# Altium schematic sheet Decode.SchDoc
size B; Author: E. Sims; Organization: Let's Build Rockets Inc.; SheetNumber: 4; SheetTotal: 6
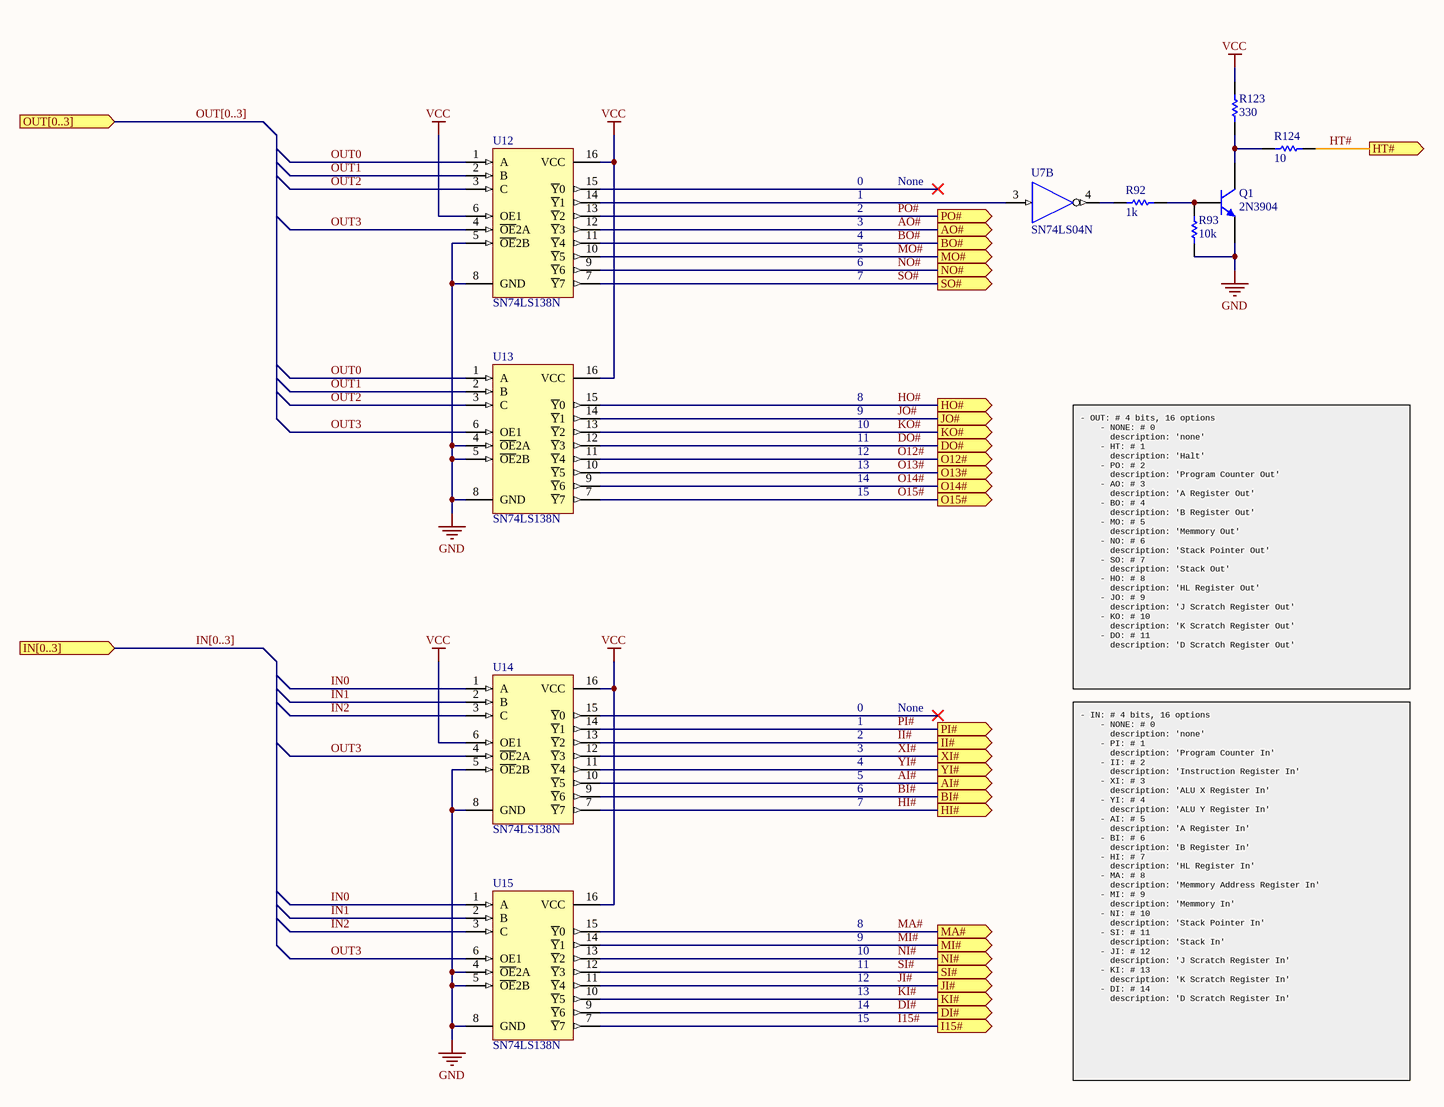
[diagram p0: Decode.SchDoc]

## Parts
Q1  2N3904  [TO-92A]
R92  value 1k  [AXIAL-0.3]  (hidden comment: Res1)
R93  value 10k  [AXIAL-0.3]  (hidden comment: Res1)
R123  value 330  [AXIAL-0.3]  (hidden comment: Res1)
R124  value 10  [AXIAL-0.3]  (hidden comment: Res1)
U7  SN74LS04N  [N014]  (part B of 6)
U12  SN74LS138N  [N016]
U13  SN74LS138N  [N016]
U14  SN74LS138N  [N016]
U15  SN74LS138N  [N016]

## Ports
AI# (out), AO# (out), BI# (out), BO# (out), DI# (out), DO# (out), HI# (out), HO# (out), HT# (out), I15# (out), II# (out), IN[0..3] (in), JI# (out), JO# (out), KI# (out), KO# (out), MA# (out), MI# (out), MO# (out), NI# (out), NO# (out), O12# (out), O13# (out), O14# (out), O15# (out), OUT[0..3] (in), PI# (out), PO# (out), SI# (out), SO# (out), XI# (out), YI# (out)

## Nets
GND: Q1.1(E) R93.2 U7.7(GND) U12.5(~{OE}2B) U12.8(GND) U13.4(~{OE}2A) U13.5(~{OE}2B) U13.8(GND) U14.5(~{OE}2B) U14.8(GND) U15.4(~{OE}2A) U15.5(~{OE}2B) U15.8(GND)
VCC: R123.1 U7.14(VCC) U12.6(OE1) U12.16(VCC) U13.16(VCC) U14.6(OE1) U14.16(VCC) U15.16(VCC)
AI#: U14.10(~{Y}5) ; port AI#
AO#: U12.12(~{Y}3) ; port AO#
BI#: U14.9(~{Y}6) ; port BI#
BO#: U12.11(~{Y}4) ; port BO#
DI#: U15.9(~{Y}6) ; port DI#
DO#: U13.12(~{Y}3) ; port DO#
HI#: U14.7(~{Y}7) ; port HI#
HO#: U13.15(~{Y}0) ; port HO#
HT#: R124.1 ; port HT#
I15#: U15.7(~{Y}7) ; port I15#
II#: U14.13(~{Y}2) ; port II#
IN0: U14.1(A) U15.1(A)
IN1: U14.2(B) U15.2(B)
IN2: U14.3(C) U15.3(C)
JI#: U15.11(~{Y}4) ; port JI#
JO#: U13.14(~{Y}1) ; port JO#
KI#: U15.10(~{Y}5) ; port KI#
KO#: U13.13(~{Y}2) ; port KO#
MA#: U15.15(~{Y}0) ; port MA#
MI#: U15.14(~{Y}1) ; port MI#
MO#: U12.10(~{Y}5) ; port MO#
NI#: U15.13(~{Y}2) ; port NI#
NO#: U12.9(~{Y}6) ; port NO#
O12#: U13.11(~{Y}4) ; port O12#
O13#: U13.10(~{Y}5) ; port O13#
O14#: U13.9(~{Y}6) ; port O14#
O15#: U13.7(~{Y}7) ; port O15#
OUT0: U12.1(A) U13.1(A)
OUT1: U12.2(B) U13.2(B)
OUT2: U12.3(C) U13.3(C)
OUT3: U12.4(~{OE}2A) U13.6(OE1) U14.4(~{OE}2A) U15.6(OE1)
PI#: U14.14(~{Y}1) ; port PI#
PO#: U12.13(~{Y}2) ; port PO#
SI#: U15.12(~{Y}3) ; port SI#
SO#: U12.7(~{Y}7) ; port SO#
XI#: U14.12(~{Y}3) ; port XI#
YI#: U14.11(~{Y}4) ; port YI#
NetQ1_2: Q1.2(B) R92.1 R93.1
NetQ1_3: Q1.3(C) R123.2 R124.2
NetR92_2: R92.2 U7.4(Y)
NetU7_3: U7.3(A) U12.14(~{Y}1)

Not connected (* = marked no-connect by the designer): U12 15(~{Y}0)*; U14 15(~{Y}0)*

## Buses and harness runs
bus IN[0..3] = port IN[0..3]
bus OUT[0..3] = port OUT[0..3]

## Notes on the sheet
- 0
- 1
- 2
- None
- 3
- 4
- 5
- 6
- 7
- 8
- 9
- 10
- 11
- 12
- 13
- 14
- 15
- - OUT: # 4 bits, 16 options
  - NONE: # 0
  description: 'none'
  - HT: # 1
  description: 'Halt'
  - PO: # 2
  description: 'Program Counter Out'
  - AO: # 3
  description: 'A Register Out'
  - BO: # 4
  description: 'B Register Out'
  - MO: # 5
  description: 'Memmory Out'
  - NO: # 6
  description: 'Stack Pointer Out'
  - SO: # 7
  description: 'Stack Out'
  - HO: # 8
  description: 'HL Register Out'
  - JO: # 9
  description: 'J Scratch Register Out'
  - KO: # 10
  description: 'K Scratch Register Out'
  - DO: # 11
  description: 'D Scratch Register Out'
- - IN: # 4 bits, 16 options
  - NONE: # 0
  description: 'none'
  - PI: # 1
  description: 'Program Counter In'
  - II: # 2
  description: 'Instruction Register In'
  - XI: # 3
  description: 'ALU X Register In'
  - YI: # 4
  description: 'ALU Y Register In'
  - AI: # 5
  description: 'A Register In'
  - BI: # 6
  description: 'B Register In'
  - HI: # 7
  description: 'HL Register In'
  - MA: # 8
  description: 'Memmory Address Register In'
  - MI: # 9
  description: 'Memmory In'
  - NI: # 10
  description: 'Stack Pointer In'
  - SI: # 11
  description: 'Stack In'
  - JI: # 12
  description: 'J Scratch Register In'
  - KI: # 13
  description: 'K Scratch Register In'
  - DI: # 14
  description: 'D Scratch Register In'
- Let's Build Rocket's Inc. Modular Paylaod System Based on TMP-010 Rev
  For more information visit https://github.com/LetsBuildRockets/Modular-Payload-System
  This work is licensed under CC BY-NC 4.0. To view a copy of this license, visit https://creativecommons.org/licenses/by-nc/4.0
- Title
- Size:
- Date:
- Assembly Variant:
- B
- Number:
- Time:
- Revision:
- Sheet
- of
- Author:
- File:

## Library data of the parts
Q1 = 2N3904: NPN General Purpose Amplifier; Published: 8-Jun-2000; LatestRevisionDate: 15-Jan-2003; LatestRevisionNote: PCB Footprint 'BCY-W3/D4.7' replaced; DatasheetVersion: 1997; PackageVersion: Sep-1998; PackageReference: TO-92A; Publisher: Altium Limited; PackageDescription: TO, Flat Index; 3 In-Line, Axial Leads; Body Dia. 4.5mm; Leads 0.51 x 0.48 mm (max); ComponentLink1Description: Manufacturer Link; ComponentLink1URL: http://www.fairchildsemi.com/; ComponentLink2Description: Datasheet; ComponentLink2URL: http://www.fairchildsemi.com/ds/2N%2F2N3904.pdf
R92 R93 R123 R124 = Res1: Resistor; Published: 8-Jun-2000; LatestRevisionDate: 17-Jul-2002; LatestRevisionNote: Re-released for DXP Platform.; PackageReference: AXIAL-0.3; Publisher: Altium Limited; PackageDescription: Axial Device, Thru-Hole; 2 Leads; 0.3 in Pin Spacing
U7 = SN74LS04N: Hex Inverter; Published: 8-Jun-2000; LatestRevisionDate: 04-Mar-2005; LatestRevisionNote: Stylized 3D Model Added.; DatasheetVersion: Mar-1988; PackageVersion: Oct-1995; PackageReference: N014; Publisher: Altium Limited; PackageDescription: DIP; 14 Leads; Row Spacing 7.62 mm; Pitch 2.54 mm; ComponentLink1Description: Manufacturer Link; ComponentLink1URL: http://www.ti.com/; ComponentLink2Description: Datasheet; ComponentLink2URL: http://www-s.ti.com/sc/ds/sn74ls04.pdf
U12-U15 = SN74LS138N: 3-Line to 8-Line Decoder / Demultiplexer; Published: 8-Jun-2000; LatestRevisionDate: 04-Mar-2005; LatestRevisionNote: Stylized 3D Model Added.; DatasheetVersion: Mar-1988; PackageVersion: Oct-1995; PackageReference: N016; Publisher: Altium Limited; PackageDescription: DIP; 16 Leads; Row Spacing 7.62 mm; Pitch 2.54 mm; Code_JEDEC: MS-001-BB; ComponentLink1Description: Manufacturer Link; ComponentLink1URL: http://www.ti.com/; ComponentLink2Description: Datasheet; ComponentLink2URL: http://www-s.ti.com/sc/ds/sn74ls138.pdf